# Altium schematic sheet 1_ESP32_schematic.schdoc.schdoc
size 426 x 302 mm; Name: A_A3; Symbol: A_A3; Device: A_A3; @Project Name: ESP32_RelayBoard; REV: 1.1; Date: 2024-06-04; Sheet: 1/1; Company: Naren Subburaj; Convert to PCB: yes; Add into BOM: yes
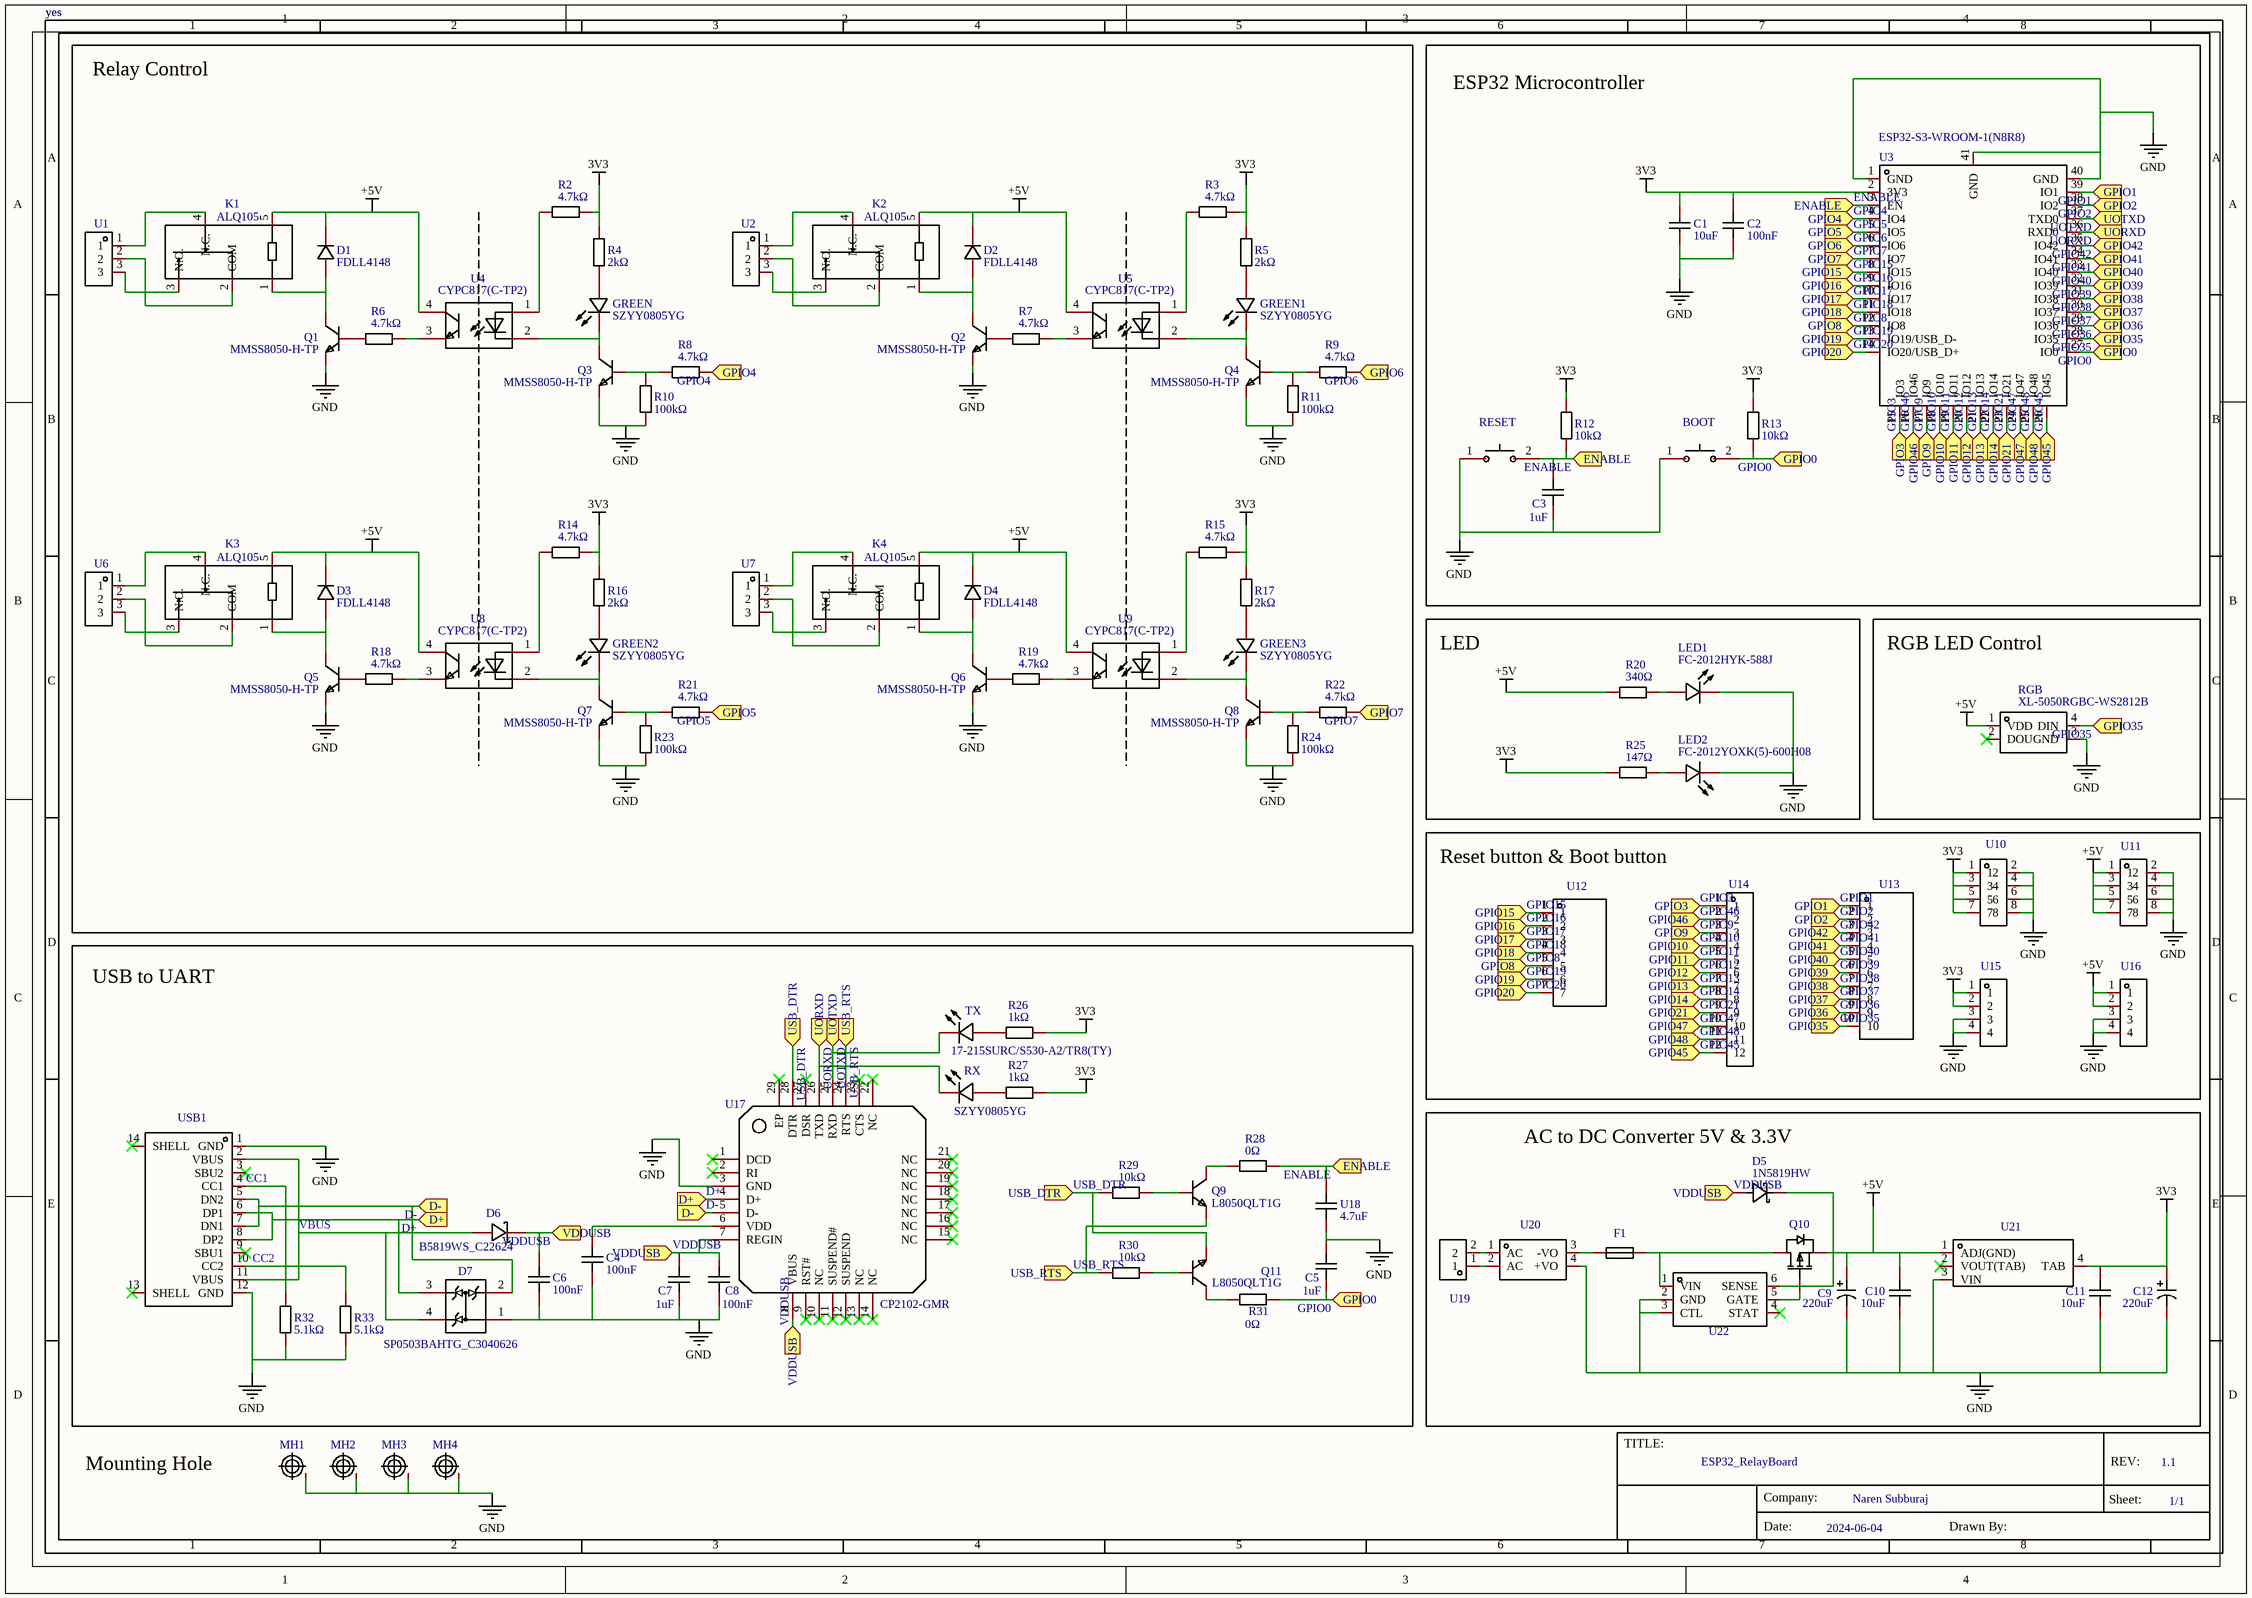
[diagram p0: 1_ESP32_schematic.schdoc.schdoc]

## Parts
BOOT  TS-1101S-C-B-B-B-A  [SW-SMD_L6.0-W3.5-LS8.0]  (value not drawn)
C1  10uF  [C0402]
C2  100nF  [C0402]
C3  1uF  [C0402]
C4  100nF  [C0402]
C5  1uF  [C0402]
C6  100nF  [C0402]
C7  1uF  [C0402]
C8  100nF  [C0402]
C9  220uF  [CAP-SMD_BD6.3-L6.6-W6.6-LS7.2-FD]
C10  10uF  [C0805]
C11  10uF  [C0805]
C12  220uF  [CAP-SMD_BD6.3-L6.6-W6.6-LS7.2-FD]
D1  FDLL4148  [SOD-80_L3.5-W1.5-RD]
D2  FDLL4148  [SOD-80_L3.5-W1.5-RD]
D3  FDLL4148  [SOD-80_L3.5-W1.5-RD]
D4  FDLL4148  [SOD-80_L3.5-W1.5-RD]
D5  1N5819HW  [SOD-123_L2.7-W1.6-LS3.7-RD-1]
D6  B5819WS_C22624  [SOD-323_L1.8-W1.3-LS2.5-RD]
D7  SP0503BAHTG_C3040626  [SOT-143-4_L2.9-W1.3-P1.92-LS2.4-BL]
F1  BSMD0805-100-6V  [F0805]  (value not drawn)
GREEN  SZYY0805YG  [LED0805-R-RD_GREEN]
GREEN1  SZYY0805YG  [LED0805-R-RD_GREEN]
GREEN2  SZYY0805YG  [LED0805-R-RD_GREEN]
GREEN3  SZYY0805YG  [LED0805-R-RD_GREEN]
K1  ALQ105  [RELAY-TH_ALQ1XX]
K2  ALQ105  [RELAY-TH_ALQ1XX]
K3  ALQ105  [RELAY-TH_ALQ1XX]
K4  ALQ105  [RELAY-TH_ALQ1XX]
LED1  FC-2012HYK-588J  [LED0805-R-RD]
LED2  FC-2012YOXK(5)-600H08  [LED0805-RD_ORANGE]
MH1  M2-MOUNTING-HOLE  [M2-MOUNTING-HOLE]  (value not drawn)
MH2  M2-MOUNTING-HOLE  [M2-MOUNTING-HOLE]  (value not drawn)
MH3  M2-MOUNTING-HOLE  [M2-MOUNTING-HOLE]  (value not drawn)
MH4  M2-MOUNTING-HOLE  [M2-MOUNTING-HOLE]  (value not drawn)
Q1  MMSS8050-H-TP  [SOT-23-3_L2.9-W1.6-P1.90-LS2.8-BR]
Q2  MMSS8050-H-TP  [SOT-23-3_L2.9-W1.6-P1.90-LS2.8-BR]
Q3  MMSS8050-H-TP  [SOT-23-3_L2.9-W1.6-P1.90-LS2.8-BR]
Q4  MMSS8050-H-TP  [SOT-23-3_L2.9-W1.6-P1.90-LS2.8-BR]
Q5  MMSS8050-H-TP  [SOT-23-3_L2.9-W1.6-P1.90-LS2.8-BR]
Q6  MMSS8050-H-TP  [SOT-23-3_L2.9-W1.6-P1.90-LS2.8-BR]
Q7  MMSS8050-H-TP  [SOT-23-3_L2.9-W1.6-P1.90-LS2.8-BR]
Q8  MMSS8050-H-TP  [SOT-23-3_L2.9-W1.6-P1.90-LS2.8-BR]
Q9  L8050QLT1G  [SOT-23-3_L2.9-W1.3-P1.90-LS2.4-BR]
Q10  FDN306P  [SOT-23-3_L3.0-W1.7-P0.95-LS2.9-BR]  (value not drawn)
Q11  L8050QLT1G  [SOT-23-3_L2.9-W1.3-P1.90-LS2.4-BR]
R2  4.7kΩ  [R0805]
R3  4.7kΩ  [R0805]
R4  2kΩ  [R0805]
R5  2kΩ  [R0805]
R6  4.7kΩ  [R0805]
R7  4.7kΩ  [R0805]
R8  4.7kΩ  [R0805]
R9  4.7kΩ  [R0805]
R10  100kΩ  [R0805]
R11  100kΩ  [R0805]
R12  10kΩ  [R0402]
R13  10kΩ  [R0402]
R14  4.7kΩ  [R0805]
R15  4.7kΩ  [R0805]
R16  2kΩ  [R0805]
R17  2kΩ  [R0805]
R18  4.7kΩ  [R0805]
R19  4.7kΩ  [R0805]
R20  340Ω  [R0805]
R21  4.7kΩ  [R0805]
R22  4.7kΩ  [R0805]
R23  100kΩ  [R0805]
R24  100kΩ  [R0805]
R25  147Ω  [R0805]
R26  1kΩ  [R0805]
R27  1kΩ  [R0805]
R28  0Ω  [R0402]
R29  10kΩ  [R0402]
R30  10kΩ  [R0402]
R31  0Ω  [R0402]
R32  5.1kΩ  [R0402]
R33  5.1kΩ  [R0402]
RESET  TS-1101S-C-B-B-B-A  [SW-SMD_L6.0-W3.5-LS8.0]  (value not drawn)
RGB  XL-5050RGBC-WS2812B  [LED-SMD_4P-L5.0-W5.0-BL_XL-5050RGBC]
RX  SZYY0805YG  [LED0805-R-RD_GREEN]
TX  17-215SURC/S530-A2/TR8(TY)  [LED0805-RD_RED]
U1  DB128L-5.08-3P-BK-S  [CONN-TH_3P-P5.08_DB128L-5.08-3P-BK-S]  (value not drawn)
U2  DB128L-5.08-3P-BK-S  [CONN-TH_3P-P5.08_DB128L-5.08-3P-BK-S]  (value not drawn)
U3  ESP32-S3-WROOM-1(N8R8)  [WIRELM-SMD_ESP32-S3-WROOM-1]
U4  CYPC817(C-TP2)  [SOP-4_L6.4-W4.6-P2.54-LS10.2-TL]
U5  CYPC817(C-TP2)  [SOP-4_L6.4-W4.6-P2.54-LS10.2-TL]
U6  DB128L-5.08-3P-BK-S  [CONN-TH_3P-P5.08_DB128L-5.08-3P-BK-S]  (value not drawn)
U7  DB128L-5.08-3P-BK-S  [CONN-TH_3P-P5.08_DB128L-5.08-3P-BK-S]  (value not drawn)
U8  CYPC817(C-TP2)  [SOP-4_L6.4-W4.6-P2.54-LS10.2-TL]
U9  CYPC817(C-TP2)  [SOP-4_L6.4-W4.6-P2.54-LS10.2-TL]
U10  ZX-PM2.54-2-4PY  [HDR-TH_8P-P2.54-V-F-R2-C4-S2.54]  (value not drawn)
U11  ZX-PM2.54-2-4PY  [HDR-TH_8P-P2.54-V-F-R2-C4-S2.54]  (value not drawn)
U12  A2541HWV-7P  [HDR-TH_7P-P2.54-V_A2541HWV-7P]  (value not drawn)
U13  A2541HWV-10P  [HDR-TH_10P-P2.54-V-F-1]  (value not drawn)
U14  ZX-PM2.54-1-12PY  [HDR-TH_12P-P2.54-V-F]  (value not drawn)
U15  HB-PH3-25414PB2GOP  [HDR-TH_4P-P2.54-V-M]  (value not drawn)
U16  HB-PH3-25414PB2GOP  [HDR-TH_4P-P2.54-V-M]  (value not drawn)
U17  CP2102-GMR  [WQFN-28_L5.0-W5.0-P0.50-BL-EP3.2]
U18  4.7uF  [C0402]
U19  DB128L-5.08-2P-BK-S  [CONN-TH_2P-P5.08_DB128L-5.08-2P-BK-S]  (value not drawn)
U20  HLK-10M05  [PWRM-TH_HLK-10M05]  (value not drawn)
U21  AMS1117-3.3_C347222  [SOT-223-4_L6.5-W3.5-P2.30-LS7.0-BR]  (value not drawn)
U22  LTC4412HVIS6#TRPBF  [TSOT-23-6_L2.9-W1.6-P0.95-LS2.8-BR]  (value not drawn)
USB1  TYPE-C 16PIN 2MD(073)  [USB-C-SMD_TYPE-C-6PIN-2MD-073]  (value not drawn)

## Blocks framed on the sheet
Relay Control: D1-D4 GREEN GREEN1-GREEN3 K1-K4 Q1-Q8 R2-R11 R14-R19 R21-R24 U1 U2 U4-U9
ESP32 Microcontroller: BOOT C1-C3 R12 R13 RESET U3
LED: LED1 LED2 R20 R25
RGB LED Control: RGB
Reset button & Boot button: U10-U16
USB to UART: C4-C8 D6 D7 Q9 Q11 R26-R33 RX TX U17 U18 USB1
AC to DC Converter 5V & 3.3V: C9-C12 D5 F1 Q10 U19-U22

## Ports
D+ (in), D- (in), ENABLE (in), GPIO0 (in), GPIO1 (in), GPIO2 (in), GPIO3 (in), GPIO4 (in), GPIO5 (in), GPIO6 (in), GPIO7 (in), GPIO8 (in), GPIO9 (in), GPIO10 (in), GPIO11 (in), GPIO12 (in), GPIO13 (in), GPIO14 (in), GPIO15 (in), GPIO16 (in), GPIO17 (in), GPIO18 (in), GPIO19 (in), GPIO20 (in), GPIO21 (in), GPIO35 (in), GPIO36 (in), GPIO37 (in), GPIO38 (in), GPIO39 (in), GPIO40 (in), GPIO41 (in), GPIO42 (in), GPIO45 (in), GPIO46 (in), GPIO47 (in), GPIO48 (in), UORXD (in), UOTXD (in), USB_DTR (in), USB_RTS (in), VDDUSB (in)

## Nets
3V3: C1.2 C2.2 C11.2 C12.1 R2.2 R3.2 R4.2 R5.2 R12.2 R13.2 R14.2 R15.2 R16.2 R17.2 R25.1 R26.1 R27.1 U3.2(3V3) U10.1 U10.3 U10.5 U10.7 U15.1 U15.2 U21.4(TAB)
+5V: C9.1 C10.2 D1.1(C) D2.1(C) D3.1(C) D4.1(C) D5.1(K) K1.5 K2.5 K3.5 K4.5 Q10.2(S) R20.1 RGB.1(VDD) U4.4(COL) U5.4(COL) U8.4(COL) U9.4(COL) U11.1 U11.3 U11.5 U11.7 U16.1 U16.2 U21.1(ADJ(GND)) U22.6(SENSE)
GND: BOOT.1 C1.1 C2.1 C3.1 C4.1 C5.2 C6.1 C7.1 C8.1 C9.2 C10.1 C11.1 C12.2 D7.1 LED1.2(K) LED2.1(-) MH1.1(GND) MH2.1(GND) MH3.1(GND) MH4.1(GND) Q1.2(E) Q2.2(E) Q3.2(E) Q4.2(E) Q5.2(E) Q6.2(E) Q7.2(E) Q8.2(E) R10.1 R11.1 R23.1 R24.1 R32.1 R33.1 RESET.1 RGB.3(GND) U3.1(GND) U3.40(GND) U3.41(GND) U10.2 U10.4 U10.6 U10.8 U11.2 U11.4 U11.6 U11.8 U15.3 U15.4 U16.3 U16.4 U17.3(GND) U18.1 U20.4(+VO) U21.3(VIN) U22.2(GND) U22.3(CTL) USB1.1(GND) USB1.12(GND)
CC1: R32.2 USB1.4(CC1)
CC2: R33.2 USB1.10(CC2)
D+: D7.3 U17.4(D+) USB1.6(DP1) USB1.8(DP2) ; port D+
D-: D7.2 U17.5(D-) USB1.5(DN2) USB1.7(DN1) ; port D-
ENABLE: C3.2 R12.1 R28.2 RESET.2 U3.3(EN) U18.2 ; port ENABLE
GPIO0: BOOT.2 C5.1 R13.1 R31.2 U3.27(IO0) ; port GPIO0
GPIO1: U3.39(IO1) U13.1 ; port GPIO1
GPIO2: U3.38(IO2) U13.2 ; port GPIO2
GPIO3: U3.15(IO3) U14.1 ; port GPIO3
GPIO4: R8.2 U3.4(IO4) ; port GPIO4
GPIO5: R21.2 U3.5(IO5) ; port GPIO5
GPIO6: R9.2 U3.6(IO6) ; port GPIO6
GPIO7: R22.2 U3.7(IO7) ; port GPIO7
GPIO8: U3.12(IO8) U12.5 ; port GPIO8
GPIO9: U3.17(IO9) U14.3 ; port GPIO9
GPIO10: U3.18(IO10) U14.4 ; port GPIO10
GPIO11: U3.19(IO11) U14.5 ; port GPIO11
GPIO12: U3.20(IO12) U14.6 ; port GPIO12
GPIO13: U3.21(IO13) U14.7 ; port GPIO13
GPIO14: U3.22(IO14) U14.8 ; port GPIO14
GPIO15: U3.8(IO15) U12.1 ; port GPIO15
GPIO16: U3.9(IO16) U12.2 ; port GPIO16
GPIO17: U3.10(IO17) U12.3 ; port GPIO17
GPIO18: U3.11(IO18) U12.4 ; port GPIO18
GPIO19: U3.13(IO19/USB_D-) U12.6 ; port GPIO19
GPIO20: U3.14(IO20/USB_D+) U12.7 ; port GPIO20
GPIO21: U3.23(IO21) U14.9 ; port GPIO21
GPIO35: RGB.4(DIN) U3.28(IO35) U13.10 ; port GPIO35
GPIO36: U3.29(IO36) U13.9 ; port GPIO36
GPIO37: U3.30(IO37) U13.8 ; port GPIO37
GPIO38: U3.31(IO38) U13.7 ; port GPIO38
GPIO39: U3.32(IO39) U13.6 ; port GPIO39
GPIO40: U3.33(IO40) U13.5 ; port GPIO40
GPIO41: U3.34(IO41) U13.4 ; port GPIO41
GPIO42: U3.35(IO42) U13.3 ; port GPIO42
GPIO45: U3.26(IO45) U14.12 ; port GPIO45
GPIO46: U3.16(IO46) U14.2 ; port GPIO46
GPIO47: U3.24(IO47) U14.10 ; port GPIO47
GPIO48: U3.25(IO48) U14.11 ; port GPIO48
UORXD: RX.2(-) U3.36(RXD0) U17.26(TXD) ; port UORXD
UOTXD: TX.1(K) U3.37(TXD0) U17.25(RXD) ; port UOTXD
USB_DTR: Q11.2(E) R29.1 U17.28(DTR) ; port USB_DTR
USB_RTS: Q9.2(E) R30.1 U17.24(RTS) ; port USB_RTS
VBUS: D6.2(A) D7.4 USB1.2(VBUS) USB1.11(VBUS)
VDDUSB: C6.2 C7.2 C8.2 D5.2(A) D6.1(K) U17.7(REGIN) U17.8(VBUS) ; port VDDUSB
NetC4_2: C4.2 U17.6(VDD)
NetD1_2: D1.2(A) K1.1 Q1.3(C)
NetD2_2: D2.2(A) K2.1 Q2.3(C)
NetD3_2: D3.2(A) K3.1 Q5.3(C)
NetD4_2: D4.2(A) K4.1 Q6.3(C)
NetF1_1: F1.1 U20.3(-VO)
NetF1_2: F1.2 Q10.3(D) U22.1(VIN)
NetGREEN1_1: GREEN1.1(+) R5.1
NetGREEN1_2: GREEN1.2(-) Q4.3(C) U5.2(CAT)
NetGREEN2_1: GREEN2.1(+) R16.1
NetGREEN2_2: GREEN2.2(-) Q7.3(C) U8.2(CAT)
NetGREEN3_1: GREEN3.1(+) R17.1
NetGREEN3_2: GREEN3.2(-) Q8.3(C) U9.2(CAT)
NetGREEN_1: GREEN.1(+) R4.1
NetGREEN_2: GREEN.2(-) Q3.3(C) U4.2(CAT)
NetK1_2: K1.2(COM) U1.2
NetK1_3: K1.3(N.O.) U1.3
NetK1_4: K1.4(N.C.) U1.1
NetK2_2: K2.2(COM) U2.2
NetK2_3: K2.3(N.O.) U2.3
NetK2_4: K2.4(N.C.) U2.1
NetK3_2: K3.2(COM) U6.2
NetK3_3: K3.3(N.O.) U6.3
NetK3_4: K3.4(N.C.) U6.1
NetK4_2: K4.2(COM) U7.2
NetK4_3: K4.3(N.O.) U7.3
NetK4_4: K4.4(N.C.) U7.1
NetLED1_1: LED1.1(A) R20.2
NetLED2_2: LED2.2(+) R25.2
NetQ1_1: Q1.1(B) R6.1
NetQ2_1: Q2.1(B) R7.1
NetQ3_1: Q3.1(B) R8.1 R10.2
NetQ4_1: Q4.1(B) R9.1 R11.2
NetQ5_1: Q5.1(B) R18.1
NetQ6_1: Q6.1(B) R19.1
NetQ7_1: Q7.1(B) R21.1 R23.2
NetQ8_1: Q8.1(B) R22.1 R24.2
NetQ9_1: Q9.1(B) R29.2
NetQ9_3: Q9.3(C) R28.1
NetQ10_1: Q10.1(G) U22.5(GATE)
NetQ11_1: Q11.1(B) R30.2
NetQ11_3: Q11.3(C) R31.1
NetR2_1: R2.1 U4.1(AN)
NetR3_1: R3.1 U5.1(AN)
NetR6_2: R6.2 U4.3(EMI)
NetR7_2: R7.2 U5.3(EMI)
NetR14_1: R14.1 U8.1(AN)
NetR15_1: R15.1 U9.1(AN)
NetR18_2: R18.2 U8.3(EMI)
NetR19_2: R19.2 U9.3(EMI)
NetR26_2: R26.2 TX.2(A)
NetR27_2: R27.2 RX.1(+)
NetU19_1: U19.1 U20.2(AC)
NetU19_2: U19.2 U20.1(AC)

Not connected (* = marked no-connect by the designer): RGB 2(DOU)*; U17 1(DCD)* 2(RI)* 9(RST#)* 10(NC)* 11(SUSPEND#)* 12(SUSPEND)* 13(NC)* 14(NC)* 15(NC)* 16(NC)* 17(NC)* 18(NC)* 19(NC)* 20(NC)* 21(NC)* 22(NC)* 23(CTS)* 27(DSR)* 29(EP)*; U21 2(VOUT(TAB))*; U22 4(STAT)*; USB1 3(SBU2)* 9(SBU1)* 13(SHELL)* 14(SHELL)*

## Notes on the sheet
- Mounting Hole
- yes
- 1
- 2
- 3
- 4
- 5
- 6
- 7
- 8
- A
- B
- C
- D
- E
- TITLE:
- ESP32_RelayBoard
- REV:
- 1.1
- Date:
- Company:
- 2024-06-04
- Naren Subburaj
- Drawn By:
- Sheet:
- 1/1

## Library data of the parts
BOOT RESET = TS-1101S-C-B-B-B-A: Manufacturer: XKB Connectivity(中国星坤); Convert to PCB: yes; Name: TS-1101S-C-B-B-B-A; Symbol: TS-1101S-C-B-B-B-A; Device: TS-1101S-C-B-B-B-A; Supplier: LCSC; Supplier Part: C609852; Manufacturer Part: TS-1101S-C-B-B-B-A; JLCPCB Part Class: Extended Part; Add into BOM: yes; Origin Footprint: SW-SMD_L6.0-W3.5-LS8.0
C1 = 10uF: Manufacturer: YAGEO(国巨); Manufacturer Part: CC0402MRX5R5BB106; Convert to PCB: yes; Name: 10uF; Symbol: 10uF; Device: 10uF; Supplier: LCSC; Supplier Part: C105884; JLCPCB Part Class: Extended Part; Add into BOM: yes; Origin Footprint: C0402
C2 C4 C6 C8 = 100nF: Manufacturer: HRE(芯声); Manufacturer Part: CSA0402X7R104K250GT; Convert to PCB: yes; Name: 100nF; Symbol: 100nF; Device: 100nF; Supplier: LCSC; Supplier Part: C3015120; JLCPCB Part Class: Extended Part; Add into BOM: yes; Origin Footprint: C0402
C3 C5 C7 = 1uF: Manufacturer: Chinocera(华瓷); Manufacturer Part: HGC0402R5105K500NTEJ; Convert to PCB: yes; Name: 1uF; Symbol: 1uF; Device: 1uF; Supplier: LCSC; Supplier Part: C7472948; JLCPCB Part Class: Extended Part; Add into BOM: yes; Origin Footprint: C0402
C9 C12 = 220uF: Manufacturer: SAMYOUNG(韩国三莹); Manufacturer Part: MVG 16V 220UF 6.3*7.7; Convert to PCB: yes; Name: 220uF; Symbol: 220uF; Device: 220uF; Supplier: LCSC; Supplier Part: C2827940; JLCPCB Part Class: Extended Part; Add into BOM: yes; Origin Footprint: CAP-SMD_BD6.3-L6.6-W6.6-LS7.2-FD
C10 C11 = 10uF: Manufacturer: FH(风华); Manufacturer Part: 0805F106M160NT; Convert to PCB: yes; Name: 10uF; Symbol: 10uF; Device: 10uF; Supplier: LCSC; Supplier Part: C90545; JLCPCB Part Class: Extended Part; Add into BOM: yes; Origin Footprint: C0805
D1-D4 = FDLL4148: Manufacturer: onsemi(安森美); Convert to PCB: yes; Name: FDLL4148; Symbol: FDLL4148; Device: FDLL4148; Supplier: LCSC; Manufacturer Part: FDLL4148; Supplier Part: C78608; JLCPCB Part Class: Extended Part; Add into BOM: yes; Origin Footprint: SOD-80_L3.5-W1.5-RD
D5 = 1N5819HW: Manufacturer: TECH PUBLIC(台舟); Convert to PCB: yes; Name: 1N5819HW; Symbol: 1N5819HW; Device: 1N5819HW; Supplier: LCSC; Supplier Part: C2905649; Manufacturer Part: 1N5819HW; JLCPCB Part Class: Extended Part; Add into BOM: yes; Origin Footprint: SOD-123_L2.7-W1.6-LS3.7-RD-1
D6 = B5819WS_C22624: Manufacturer: CJ(江苏长电/长晶); Convert to PCB: yes; Name: B5819WS_C22624; Symbol: B5819WS_C22624; Device: B5819WS_C22624; Supplier: LCSC; Manufacturer Part: B5819WS; Supplier Part: C22624; JLCPCB Part Class: Extended Part; Add into BOM: yes; Origin Footprint: SOD-323_L1.8-W1.3-LS2.5-RD
D7 = SP0503BAHTG_C3040626: Manufacturer: TECH PUBLIC(台舟); Convert to PCB: yes; Name: SP0503BAHTG_C3040626; Symbol: SP0503BAHTG_C3040626; Device: SP0503BAHTG_C3040626; Supplier: LCSC; Supplier Part: C3040626; Manufacturer Part: SP0503BAHTG; JLCPCB Part Class: Extended Part; Add into BOM: yes; Origin Footprint: SOT-143-4_L2.9-W1.3-P1.92-LS2.4-BL
F1 = BSMD0805-100-6V: Manufacturer: BHFUSE(佰宏); Convert to PCB: yes; Name: BSMD0805-100-6V; Symbol: BSMD0805-100-6V; Device: BSMD0805-100-6V; Supplier: LCSC; Supplier Part: C883112; Manufacturer Part: BSMD0805-100-6V; JLCPCB Part Class: Extended Part; Add into BOM: yes; Origin Footprint: F0805
GREEN GREEN1-GREEN3 RX = SZYY0805YG: Manufacturer: yongyu(永裕光电); Convert to PCB: yes; Name: SZYY0805YG; Symbol: SZYY0805YG; Device: SZYY0805YG; Supplier: LCSC; Supplier Part: C434435; Manufacturer Part: SZYY0805YG; JLCPCB Part Class: Extended Part; Add into BOM: yes; Origin Footprint: LED0805-R-RD_GREEN
K1-K4 = ALQ105: Manufacturer: PANASONIC(松下); Convert to PCB: yes; Name: ALQ105; Symbol: ALQ105; Device: ALQ105; Supplier: LCSC; Supplier Part: C719517; Manufacturer Part: ALQ105; JLCPCB Part Class: Extended Part; Add into BOM: yes; Origin Footprint: RELAY-TH_ALQ1XX
LED1 = FC-2012HYK-588J: Manufacturer: 国星光电; Manufacturer Part: NCD0805Y1; Convert to PCB: yes; Name: FC-2012HYK-588J; Symbol: FC-2012HYK-588J; Device: FC-2012HYK-588J; Supplier: LCSC; Supplier Part: C84261; JLCPCB Part Class: Extended Part; Add into BOM: yes; Origin Footprint: LED0805-R-RD
LED2 = FC-2012YOXK(5)-600H08: Manufacturer: 国星光电; Manufacturer Part: NCD0805O1; Convert to PCB: yes; Name: FC-2012YOXK(5)-600H08; Symbol: FC-2012YOXK(5)-600H08; Device: FC-2012YOXK(5)-600H08; Supplier: LCSC; Supplier Part: C84262; JLCPCB Part Class: Extended Part; Add into BOM: yes; Origin Footprint: LED0805-RD_ORANGE
MH1-MH4 = M2-MOUNTING-HOLE: Convert to PCB: yes; Name: M2-MOUNTING-HOLE; Symbol: M2-MOUNTING-HOLE; Device: M2-MOUNTING-HOLE; Add into BOM: yes; Origin Footprint: M2-MOUNTING-HOLE
Q1-Q8 = MMSS8050-H-TP: Manufacturer: MCC(美微科); Convert to PCB: yes; Name: MMSS8050-H-TP; Symbol: MMSS8050-H-TP; Device: MMSS8050-H-TP; Supplier: LCSC; Manufacturer Part: MMSS8050-H-TP; Supplier Part: C90158; JLCPCB Part Class: Extended Part; Add into BOM: yes; Origin Footprint: SOT-23-3_L2.9-W1.6-P1.90-LS2.8-BR
Q9 Q11 = L8050QLT1G: Manufacturer: LRC(乐山无线电); Convert to PCB: yes; Name: L8050QLT1G; Symbol: L8050QLT1G; Device: L8050QLT1G; Supplier: LCSC; Manufacturer Part: L8050QLT1G; Supplier Part: C49581; JLCPCB Part Class: Extended Part; Add into BOM: yes; Origin Footprint: SOT-23-3_L2.9-W1.3-P1.90-LS2.4-BR
Q10 = FDN306P: Manufacturer: onsemi(安森美); Convert to PCB: yes; Name: FDN306P; Symbol: FDN306P; Device: FDN306P; Supplier: LCSC; Supplier Part: C154510; Manufacturer Part: FDN306P; JLCPCB Part Class: Extended Part; Add into BOM: yes; Origin Footprint: SOT-23-3_L3.0-W1.7-P0.95-LS2.9-BR
R2 R3 R6-R9 R14 R15 R18 R19 R21 R22 = 4.7kΩ: Manufacturer: UNI-ROYAL(厚声); Manufacturer Part: 0805W8F4701T5E; Convert to PCB: yes; Name: 4.7kΩ; Symbol: 4.7kΩ; Device: 4.7kΩ; Supplier: LCSC; Supplier Part: C17673; JLCPCB Part Class: Basic Part; Add into BOM: yes; Origin Footprint: R0805
R4 R5 R16 R17 = 2kΩ: Manufacturer: UNI-ROYAL(厚声); Manufacturer Part: 0805W8F2001T5E; Convert to PCB: yes; Name: 2kΩ; Symbol: 2kΩ; Device: 2kΩ; Supplier: LCSC; Supplier Part: C17604; JLCPCB Part Class: Basic Part; Add into BOM: yes; Origin Footprint: R0805
R10 R11 R23 R24 = 100kΩ: Manufacturer: UNI-ROYAL(厚声); Manufacturer Part: 0805W8F1003T5E; Convert to PCB: yes; Name: 100kΩ; Symbol: 100kΩ; Device: 100kΩ; Supplier: LCSC; Supplier Part: C149504; JLCPCB Part Class: Basic Part; Add into BOM: yes; Origin Footprint: R0805
R12 R13 R29 R30 = 10kΩ: Manufacturer: YAGEO(国巨); Manufacturer Part: RT0402DRE0710KL; Convert to PCB: yes; Name: 10kΩ; Symbol: 10kΩ; Device: 10kΩ; Supplier: LCSC; Supplier Part: C326912; JLCPCB Part Class: Extended Part; Add into BOM: yes; Origin Footprint: R0402
R20 = 340Ω: Manufacturer: LIZ(丽智电子); Manufacturer Part: CR0805F83400G; Convert to PCB: yes; Name: 340Ω; Symbol: 340Ω; Device: 340Ω; Supplier: LCSC; Supplier Part: C101671; JLCPCB Part Class: Extended Part; Add into BOM: yes; Origin Footprint: R0805
R25 = 147Ω: Manufacturer: BOURNS; Manufacturer Part: CR0805-FX-1470ELF; Convert to PCB: yes; Name: 147Ω; Symbol: 147Ω; Device: 147Ω; Supplier: LCSC; Supplier Part: C203753; JLCPCB Part Class: Extended Part; Add into BOM: yes; Origin Footprint: R0805
R26 R27 = 1kΩ: Manufacturer: Tyohm(幸亚电阻); Manufacturer Part: RMC08051K5%N; Convert to PCB: yes; Name: 1kΩ; Symbol: 1kΩ; Device: 1kΩ; Supplier: LCSC; Supplier Part: C269727; JLCPCB Part Class: Extended Part; Add into BOM: yes; Origin Footprint: R0805
R28 R31 = 0Ω: Manufacturer: YAGEO(国巨); Manufacturer Part: RC0402FR-070RL; Convert to PCB: yes; Name: 0Ω; Symbol: 0Ω; Device: 0Ω; Supplier: LCSC; Supplier Part: C106231; JLCPCB Part Class: Extended Part; Add into BOM: yes; Origin Footprint: R0402
R32 R33 = 5.1kΩ: Manufacturer: Tyohm(幸亚电阻); Manufacturer Part: RMC04025.1K1%N; Convert to PCB: yes; Name: 5.1kΩ; Symbol: 5.1kΩ; Device: 5.1kΩ; Supplier: LCSC; Supplier Part: C325521; JLCPCB Part Class: Extended Part; Add into BOM: yes; Origin Footprint: R0402
RGB = XL-5050RGBC-WS2812B: Manufacturer: XINGLIGHT(成兴光); Convert to PCB: yes; Name: XL-5050RGBC-WS2812B; Symbol: XL-5050RGBC-WS2812B; Device: XL-5050RGBC-WS2812B; Supplier: LCSC; Supplier Part: C2843785; Manufacturer Part: XL-5050RGBC-WS2812B; JLCPCB Part Class: Extended Part; Add into BOM: yes; Origin Footprint: LED-SMD_4P-L5.0-W5.0-BL_XL-5050RGBC
TX = 17-215SURC/S530-A2/TR8(TY): Manufacturer: EVERLIGHT(亿光); Convert to PCB: yes; Name: 17-215SURC/S530-A2/TR8(TY); Symbol: 17-215SURC/S530-A2/TR8(TY); Device: 17-215SURC/S530-A2/TR8(TY); Supplier: LCSC; Manufacturer Part: 17-215SURC/S530-A2/TR8; Supplier Part: C142306; JLCPCB Part Class: Extended Part; Add into BOM: yes; Origin Footprint: LED0805-RD_RED
U1 U2 U6 U7 = DB128L-5.08-3P-BK-S: Manufacturer: DORABO(地博电气); Convert to PCB: yes; Name: DB128L-5.08-3P-BK-S; Symbol: DB128L-5.08-3P-BK-S; Device: DB128L-5.08-3P-BK-S; Supplier: LCSC; Supplier Part: C430602; Manufacturer Part: DB128L-5.08-3P-BK-S; JLCPCB Part Class: Extended Part; Add into BOM: yes; Origin Footprint: CONN-TH_3P-P5.08_DB128L-5.08-3P-BK-S
U3 = ESP32-S3-WROOM-1(N8R8): Manufacturer: ESPRESSIF(乐鑫); Manufacturer Part: ESP32-S3-WROOM-1-N8R8; Convert to PCB: yes; Name: ESP32-S3-WROOM-1(N8R8); Symbol: ESP32-S3-WROOM-1(N8R8); Device: ESP32-S3-WROOM-1(N8R8); Supplier: LCSC; Supplier Part: C2913201; JLCPCB Part Class: Extended Part; Add into BOM: yes; Origin Footprint: WIRELM-SMD_ESP32-S3-WROOM-1
U4 U5 U8 U9 = CYPC817(C-TP2): Manufacturer: OCIC(卓睿科); Convert to PCB: yes; Name: CYPC817(C-TP2); Symbol: CYPC817(C-TP2); Device: CYPC817(C-TP2); Supplier: LCSC; Supplier Part: C385058; Manufacturer Part: CYPC817(C-TP2); JLCPCB Part Class: Extended Part; Add into BOM: yes; Origin Footprint: SOP-4_L6.4-W4.6-P2.54-LS10.2-TL
U10 U11 = ZX-PM2.54-2-4PY: Manufacturer: Megastar(兆星); Convert to PCB: yes; Name: ZX-PM2.54-2-4PY; Symbol: ZX-PM2.54-2-4PY; Device: ZX-PM2.54-2-4PY; Supplier: LCSC; Supplier Part: C7499340; Manufacturer Part: ZX-PM2.54-2-4PY; JLCPCB Part Class: Extended Part; Add into BOM: yes; Origin Footprint: HDR-TH_8P-P2.54-V-F-R2-C4-S2.54
U12 = A2541HWV-7P: Manufacturer: CJT(长江连接器); Convert to PCB: yes; Name: A2541HWV-7P; Symbol: A2541HWV-7P; Device: A2541HWV-7P; Supplier: LCSC; Supplier Part: C225504; Manufacturer Part: A2541HWV-7P; JLCPCB Part Class: Extended Part; Add into BOM: yes; Origin Footprint: HDR-TH_7P-P2.54-V_A2541HWV-7P
U13 = A2541HWV-10P: Manufacturer: CJT(长江连接器); Convert to PCB: yes; Name: A2541HWV-10P; Symbol: A2541HWV-10P; Device: A2541HWV-10P; Supplier: LCSC; Supplier Part: C225507; Manufacturer Part: A2541HWV-10P; JLCPCB Part Class: Extended Part; Add into BOM: yes; Origin Footprint: HDR-TH_10P-P2.54-V-F-1
U14 = ZX-PM2.54-1-12PY: Manufacturer: Megastar(兆星); Convert to PCB: yes; Name: ZX-PM2.54-1-12PY; Symbol: ZX-PM2.54-1-12PY; Device: ZX-PM2.54-1-12PY; Supplier: LCSC; Supplier Part: C7499331; Manufacturer Part: ZX-PM2.54-1-12PY; Add into BOM: yes; Origin Footprint: HDR-TH_12P-P2.54-V-F
U15 U16 = HB-PH3-25414PB2GOP: Manufacturer: HANBO(汉博); Convert to PCB: yes; Name: HB-PH3-25414PB2GOP; Symbol: HB-PH3-25414PB2GOP; Device: HB-PH3-25414PB2GOP; Supplier: LCSC; Supplier Part: C6332197; Manufacturer Part: HB-PH3-25414PB2GOP; JLCPCB Part Class: Extended Part; Add into BOM: yes; Origin Footprint: HDR-TH_4P-P2.54-V-M
U17 = CP2102-GMR: Manufacturer: SKYWORKS/SILICON LABS(芯科); Convert to PCB: yes; Name: CP2102-GMR; Symbol: CP2102-GMR; Device: CP2102-GMR; Supplier: LCSC; Manufacturer Part: CP2102-GMR; Supplier Part: C6568; JLCPCB Part Class: Extended Part; Add into BOM: yes; Origin Footprint: WQFN-28_L5.0-W5.0-P0.50-BL-EP3.2
U18 = 4.7uF: Manufacturer: Chinocera(华瓷); Manufacturer Part: HGC0402R5475K100NTEJ; Convert to PCB: yes; Name: 4.7uF; Symbol: 4.7uF; Device: 4.7uF; Supplier: LCSC; Supplier Part: C7472956; JLCPCB Part Class: Extended Part; Add into BOM: yes; Origin Footprint: C0402
U19 = DB128L-5.08-2P-BK-S: Manufacturer: DORABO(地博电气); Convert to PCB: yes; Name: DB128L-5.08-2P-BK-S; Symbol: DB128L-5.08-2P-BK-S; Device: DB128L-5.08-2P-BK-S; Supplier: LCSC; Supplier Part: C430601; Manufacturer Part: DB128L-5.08-2P-BK-S; JLCPCB Part Class: Extended Part; Add into BOM: yes; Origin Footprint: CONN-TH_2P-P5.08_DB128L-5.08-2P-BK-S
U20 = HLK-10M05: Manufacturer: HI-LINK(海凌科); Convert to PCB: yes; Name: HLK-10M05; Symbol: HLK-10M05; Device: HLK-10M05; Supplier: LCSC; Supplier Part: C403745; Manufacturer Part: HLK-10M05; JLCPCB Part Class: Extended Part; Add into BOM: yes; Origin Footprint: PWRM-TH_HLK-10M05
U21 = AMS1117-3.3_C347222: Manufacturer: UMW(友台半导体); Convert to PCB: yes; Name: AMS1117-3.3_C347222; Symbol: AMS1117-3.3_C347222; Device: AMS1117-3.3_C347222; Supplier: LCSC; Supplier Part: C347222; Manufacturer Part: AMS1117-3.3; JLCPCB Part Class: Extended Part; Add into BOM: yes; Origin Footprint: SOT-223-4_L6.5-W3.5-P2.30-LS7.0-BR
U22 = LTC4412HVIS6#TRPBF: Manufacturer: ADI(亚德诺); Convert to PCB: yes; Name: LTC4412HVIS6#TRPBF; Symbol: LTC4412HVIS6#TRPBF; Device: LTC4412HVIS6#TRPBF; Supplier: LCSC; Supplier Part: C462626; Manufacturer Part: LTC4412HVIS6#TRPBF; JLCPCB Part Class: Extended Part; Add into BOM: yes; Origin Footprint: TSOT-23-6_L2.9-W1.6-P0.95-LS2.8-BR
USB1 = TYPE-C 16PIN 2MD(073): Manufacturer: SHOU HAN(首韩); Convert to PCB: yes; Name: TYPE-C 16PIN 2MD(073); Symbol: TYPE-C 16PIN 2MD(073); Device: TYPE-C 16PIN 2MD(073); Supplier: LCSC; Supplier Part: C2765186; Manufacturer Part: TYPE-C 16PIN 2MD(073); JLCPCB Part Class: Extended Part; Add into BOM: yes; Origin Footprint: USB-C-SMD_TYPE-C-6PIN-2MD-073